# EAGLE schematic TRV_MRF49_U (EAGLE 6.2)
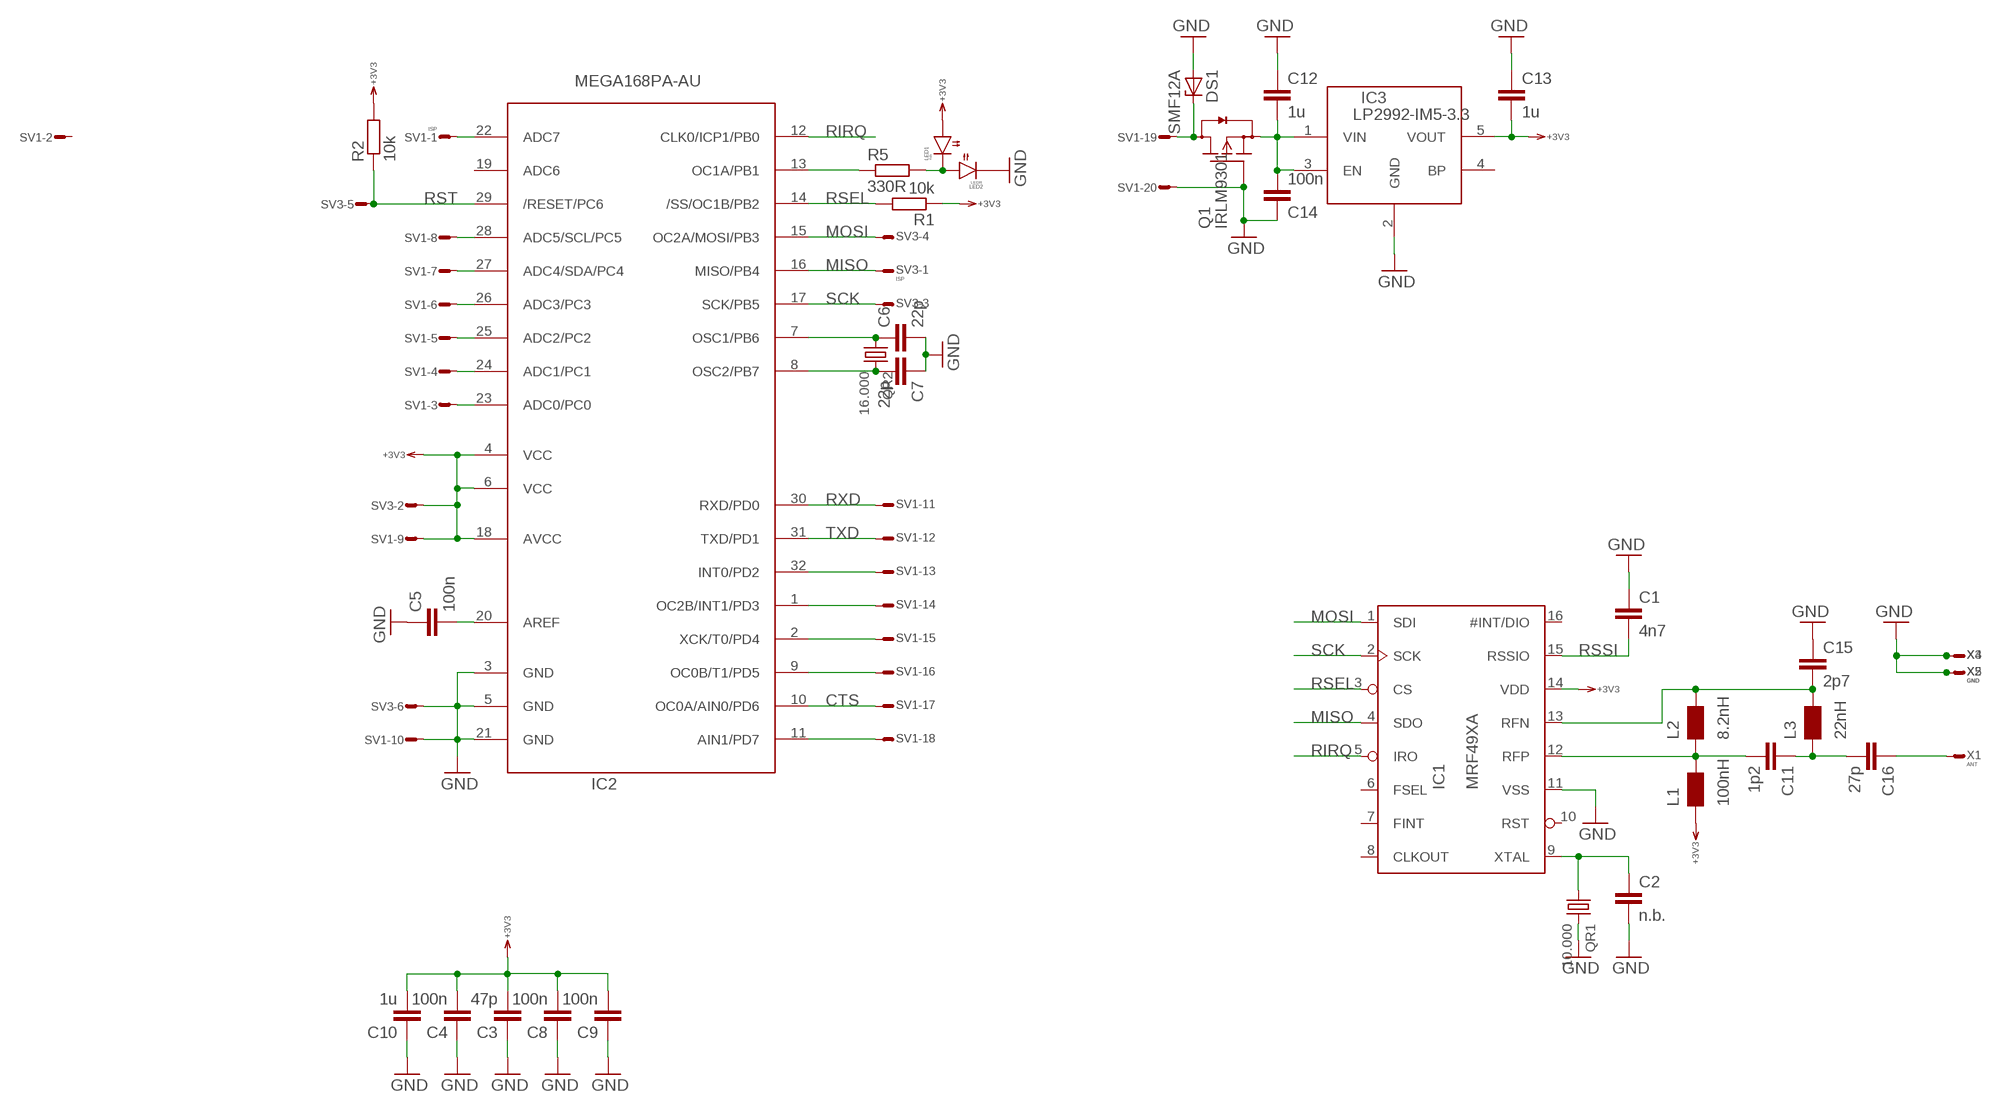
[diagram p0: schematic, sheet 1]

## Parts
C1  4n7  C0603  [0603]
C2  n.b.  C0603  [0603]
C3  47p  C0603  [0603]
C4  100n  C0603  [0603]
C5  100n  C0603  [0603]
C6  22p  C0603  [0603]
C7  22p  C0603  [0603]
C8  100n  C0603  [0603]
C9  100n  C0603  [0603]
C10  1u  C0603  [0603]
C11  1p2  C0603  [0603]
C12  1u  C0603  [0603]
C13  1u  C0603  [0603]
C14  100n  C0603  [0603]
C15  2p7  C0603  [0603]
C16  27p  C0603  [0603]
DS1  SMF12A  TVS-DSMF  [SMF]
IC1  MRF49XA  [TSSOP16]
IC2  MEGA168PA-AU  MEGA168PA  [TQFP32-08]
IC3  LP2992-IM5-3.3  LDO  [SOT23-5]
L1  100nH  L0603  [0603]
L2  8.2nH  L0603  [0603]
L3  22nH  L0603  [0603]
LED1  n.b.  LED0603  [0603]
LED2  LEDR  LED0603  [0603]
Q1  IRLM9301  FET-PDSOT23  [SOT23]
QR1  10.000  Q49UV  [HC49U-V]
QR2  16.000  Q49UV  [HC49U-V]
R1  10k  R0603  [0603]
R2  10k  R0603  [0603]
R5  330R  R0603  [0603]
SV1  ISP  ML20E  [ML20]
SV3  ISP  ML6E  [ML6]
X1  ANT  WIREPADS2.54/1.27  [S2.54/1.27]
X2  GND  WIREPADS2.54/1.27  [S2.54/1.27]
X3  WIREPADS2.54/1.27  [S2.54/1.27]
X4  WIREPADS2.54/1.27  [S2.54/1.27]
X5  GND  WIREPADS2.54/1.27  [S2.54/1.27]

## Nets
+3V3: C3.2 C4.2 C8.2 C9.2 C10.2 C13.2 IC1.14(VDD) IC2.4(VCC) IC2.6(VCC) IC2.18(AVCC) IC3.5(VOUT) L1.1 LED1.1(A) R1.1 R2.2 SV1.9 SV3.2
CTS: IC2.10(OC0A/AIN0/PD6) SV1.17
GND: C1.1 C2.2 C3.1 C4.1 C5.1 C6.2 C7.1 C8.1 C9.1 C10.1 C12.1 C13.1 C14.1 C15.1 DS1.A IC1.11(VSS) IC2.3(GND) IC2.5(GND) IC2.21(GND) IC3.2(GND) LED2.2(C) Q1.1(G) QR1.2 SV1.10 SV1.20 SV3.6 X2.1(S) X3.1(S) X4.1(S) X5.1(S)
MISO: IC1.4(SDO) IC2.16(MISO/PB4) SV3.1
MOSI: IC1.1(SDI) IC2.15(OC2A/MOSI/PB3) SV3.4
N$1: IC2.22(ADC7) SV1.1
N$2: C11.2 IC1.12(RFP) L1.2 L2.1
N$3: IC2.24(ADC1/PC1) SV1.4
N$4: C2.1 IC1.9(XTAL) QR1.1
N$5: DS1.C Q1.3(D) SV1.19
N$6: IC2.23(ADC0/PC0) SV1.3
N$7: C5.2 IC2.20(AREF)
N$8: IC2.25(ADC2/PC2) SV1.5
N$9: IC2.26(ADC3/PC3) SV1.6
N$10: IC2.27(ADC4/SDA/PC4) SV1.7
N$11: IC2.28(ADC5/SCL/PC5) SV1.8
N$12: C12.2 C14.2 IC3.1(VIN) IC3.3(EN) Q1.2(S)
N$13: IC2.9(OC0B/T1/PD5) SV1.16
N$14: IC2.11(AIN1/PD7) SV1.18
N$15: C15.2 IC1.13(RFN) L2.2 L3.2
N$16: IC2.1(OC2B/INT1/PD3) SV1.14
N$17: IC2.2(XCK/T0/PD4) SV1.15
N$18: C6.1 IC2.7(OSC1/PB6) QR2.1
N$19: C7.2 IC2.8(OSC2/PB7) QR2.2
N$20: IC2.32(INT0/PD2) SV1.13
N$21: LED1.2(C) LED2.1(A) R5.2
N$22: IC2.13(OC1A/PB1) R5.1
N$24: C11.1 C16.2 L3.1
N$25: C16.1 X1.1(S)
RIRQ: IC1.5(IRO) IC2.12(CLK0/ICP1/PB0)
RSEL: IC1.3(CS) IC2.14(/SS/OC1B/PB2) R1.2
RSSI: C1.2 IC1.15(RSSIO)
RST: IC2.29(/RESET/PC6) R2.1 SV3.5
RXD: IC2.30(RXD/PD0) SV1.11
SCK: IC1.2(SCK) IC2.17(SCK/PB5) SV3.3
TXD: IC2.31(TXD/PD1) SV1.12
Unconnected: IC1.6(FSEL) IC1.7(FINT) IC1.8(CLKOUT) IC1.10(RST) IC1.16(#INT/DIO) IC2.19(ADC6) IC3.4(BP) SV1.2

## Library data of the parts
C1-C16 = RCL:C: Capacitor SMD
DS1 = Diode:TVS-D: DIODE
IC1 = Other:MRF49XA
IC2 = atmel:MEGA168P: MCU, 4/8/16k, TQFP32
IC3 = DCDC:LDO
L1-L3 = RCL:L
LED1 LED2 = Optic:LED
Q1 = Transistor:FET-PD
QR1 QR2 = QUARTZ:Q
R1 R2 R5 = RCL:R: Resistor SMD
SV1 = Conn:ML20?E: HARTING
SV3 = Conn:ML6E: HARTING
X1-X5 = Conn:WIREPAD: Wire PAD connect wire on PCB